# EAGLE schematic OnBoardTelemetry (EAGLE 9.1.0)
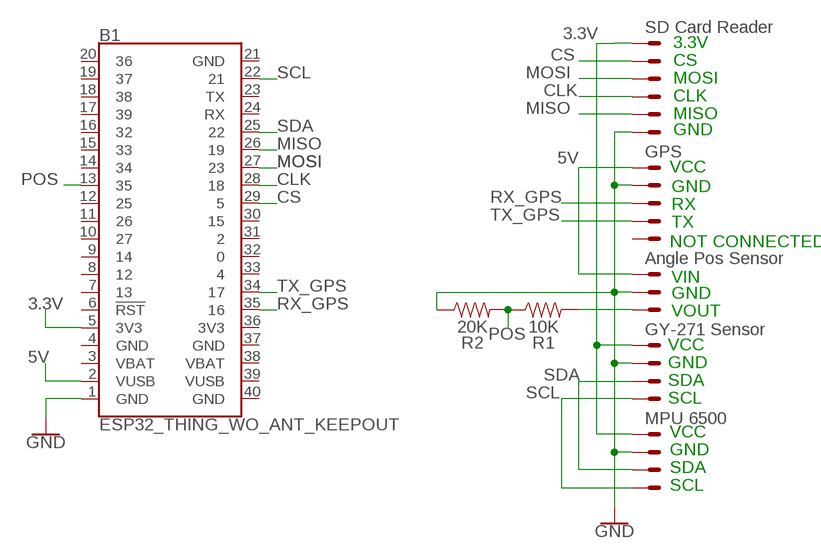
[diagram p0: schematic, sheet 1]

## Parts
B1  ESP32_THING_WO_ANT_KEEPOUT  [ESP32_THING_NO_ANT]
R1  10K  10KOHM-0402-1/10W-0.1%  [0402-TIGHT]
R2  20K  10KOHM-0402-1/10W-0.1%  [0402-TIGHT]
X1  SD Card Reader  22-23-2061  [22-23-2061]
X2  GPS  22-23-2051  [22-23-2051]
X3  Angle Pos Sensor  22-23-2031  [22-23-2031]
X4  GY-271 Sensor  22-23-2041  [22-23-2041]
X5  MPU 6500  22-23-2041  [22-23-2041]

## Nets
3.3V: B1.5(3V3) X1.1 X4.1 X5.1
5V: B1.2(VUSB) X2.1 X3.1
CLK: B1.28 X1.4
CS: B1.29 X1.2
GND: R2.1 X1.6 X2.2 X3.2 X4.2 X5.2
MISO: B1.26 X1.5
MOSI: B1.27 X1.3
N$10: R1.2 X3.3
N$20: B1.1(GND) ; supply symbol labelled GND
POS: B1.13 R1.1 R2.2
RX_GPS: B1.35 X2.3
SCL: B1.22 X4.4 X5.4
SDA: B1.25 X4.3 X5.3
TX_GPS: B1.34 X2.4
Unconnected: B1.3(VBAT) B1.4(GND) B1.6(!RST!) B1.7 B1.8 B1.9 B1.10 B1.11 B1.12 B1.14 B1.15 B1.16 B1.17 B1.18 B1.19 B1.20 B1.21(GND) B1.23(TX) B1.24(RX) B1.30 B1.31 B1.32 B1.33 B1.36(3V3) B1.37(GND) B1.38(VBAT) B1.39(VUSB) B1.40(GND) X2.5

## Notes on the sheet
- 3.3V
- CS
- MOSI
- CLK
- MISO
- GND
- VCC
- GND
- RX
- TX
- NOT CONNECTED
- VIN
- GND
- VOUT
- VCC
- GND
- SDA
- SCL
- VCC
- GND
- SDA
- SCL

## Library data of the parts
B1 = SparkFun-Boards:ESP32_THING: SparkFun ESP32 Thing Board Pins, silkscreen, and logos matching the layout of the SparkFun ESP32 Thing <https://www.sparkfun.com/products/13907> Dimensions: 2.32" x 1.00"
R1 = SparkFun-Resistors:10KOHM: 10kΩ resistor A resistor is a passive two-terminal electrical component that implements electrical resistance as a circuit element. Resistors act to reduce current flow, and, at the same time, act to lower voltage levels within circuits. - Wikipedia; PROD_ID: RES-16147
R2 = SparkFun-Resistors:10KOHM: 10kΩ resistor A resistor is a passive two-terminal electrical component that implements electrical resistance as a circuit element. Resistors act to reduce current flow, and, at the same time, act to lower voltage levels within circuits. - Wikipedia; PROD_ID: RES-16147; VALUE: 10K
X1 = con-molex:22-23-2061: .100" (2.54mm) Center Header - 6 Pin; MF: MOLEX; MPN: 22-23-2061; OC_FARNELL: 1462922; OC_NEWARK: 27C1933
X2 = con-molex:22-23-2051: .100" (2.54mm) Center Header - 5 Pin; MF: MOLEX; MPN: 22-23-2051; OC_FARNELL: 1462952; OC_NEWARK: 38C9178
X3 = con-molex:22-23-2031: .100" (2.54mm) Center Header - 3 Pin; MF: MOLEX; MPN: 22-23-2031; OC_FARNELL: 1462950; OC_NEWARK: 30C0862
X4 X5 = con-molex:22-23-2041: .100" (2.54mm) Center Header - 4 Pin; MF: MOLEX; MPN: 22-23-2041; OC_FARNELL: 1462920; OC_NEWARK: 38C0355